# EasyEDA schematic ZYF-02-0-R-8A8K64D4-SCH.json
TITLE: Sheet_1; REV: 1.0; Date: 2023-05-22; Sheet: 1/1; Drawn By: zhaohad; Company: Your Company
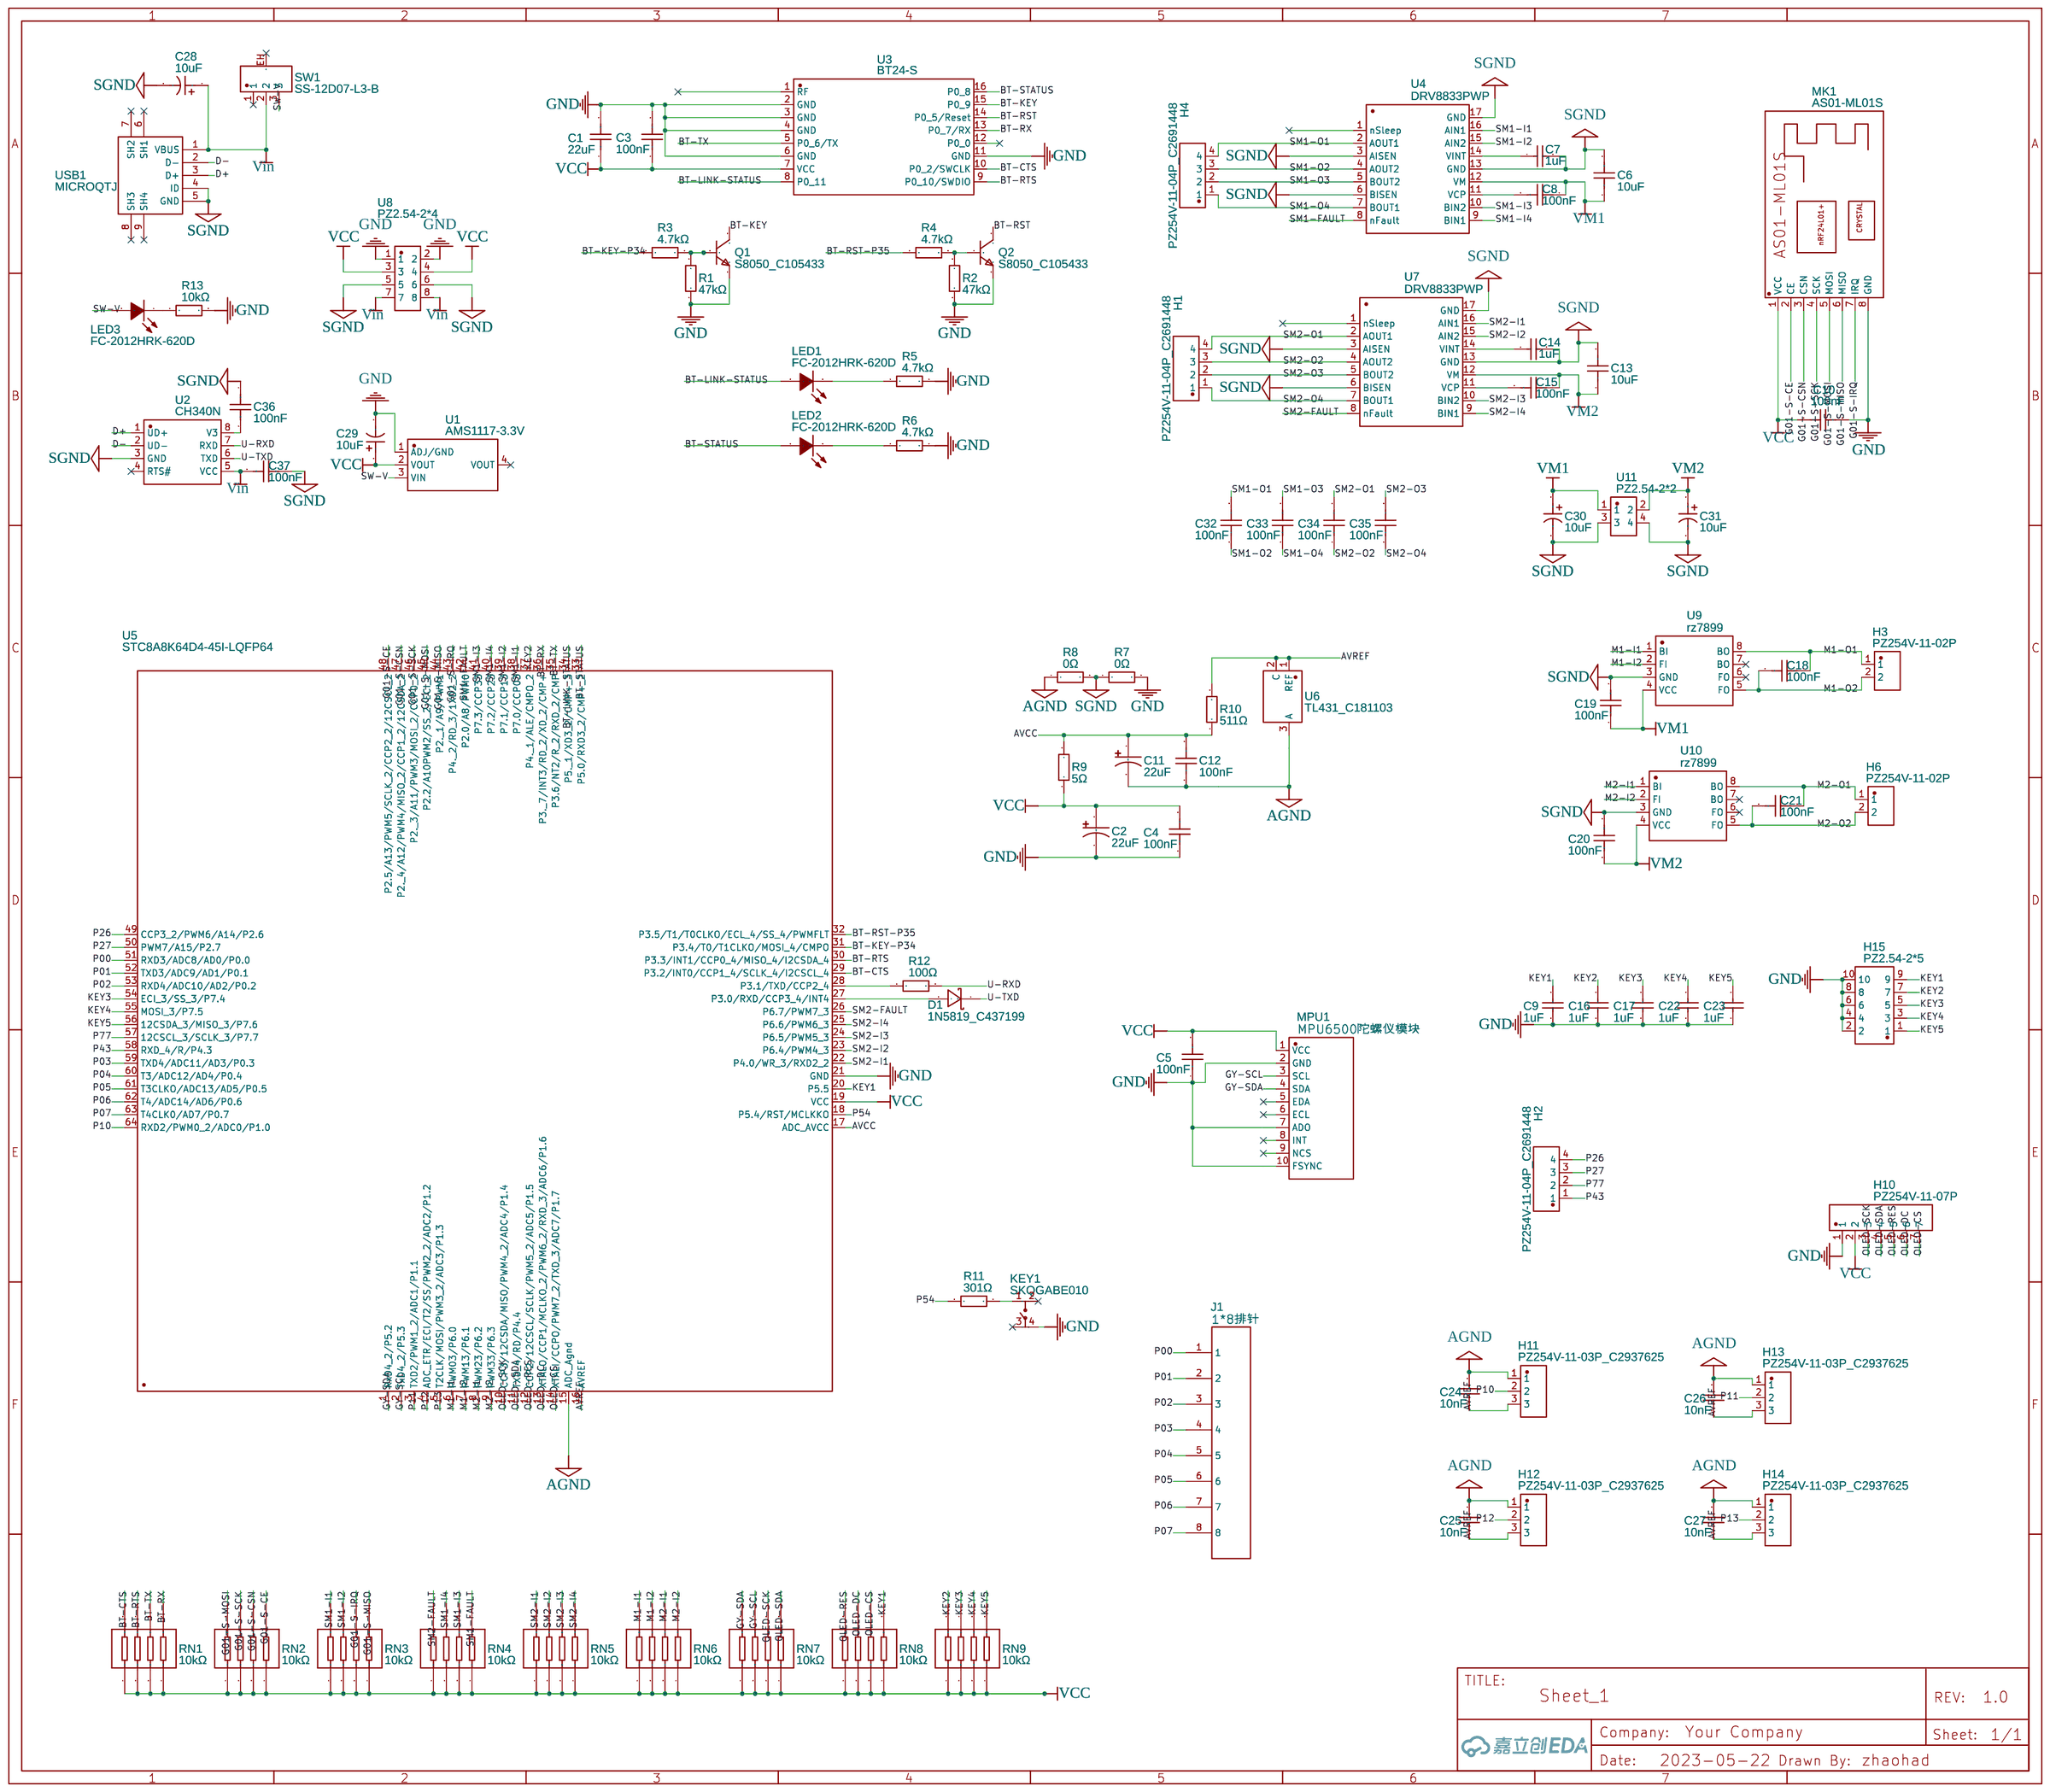
[diagram p0: schematic sheet]

## Parts
C1  22uF  [C0603]
C2  22uF  [CAP-SMD_BD6.3-L6.6-W6.6-FD]
C3  100nF  [C0603]
C4  100nF  [C0603]
C5  100nF  [C0603]
C6  10uF  [C0603]
C7  1uF  [C0603]
C8  100nF  [C0603]
C9  1uF  [C0603]
C10  100nF  [C0603]
C11  22uF  [CAP-SMD_BD6.3-L6.6-W6.6-FD]
C12  100nF  [C0603]
C13  10uF  [C0603]
C14  1uF  [C0603]
C15  100nF  [C0603]
C16  1uF  [C0603]
C17  1uF  [C0603]
C18  100nF  [C0603]
C19  100nF  [C0603]
C20  100nF  [C0603]
C21  100nF  [C0603]
C22  1uF  [C0603]
C23  1uF  [C0603]
C24  10nF  [C0603]
C25  10nF  [C0603]
C26  10nF  [C0603]
C27  10nF  [C0603]
C28  10uF  [CAP-SMD_BD5.0-L5.3-W5.3-LS6.3-FD]
C29  10uF  [CAP-SMD_BD5.0-L5.3-W5.3-LS6.3-FD]
C30  10uF  [CAP-SMD_BD5.0-L5.3-W5.3-LS6.3-FD]
C31  10uF  [CAP-SMD_BD5.0-L5.3-W5.3-LS6.3-FD]
C32  100nF  [C0603]
C33  100nF  [C0603]
C34  100nF  [C0603]
C35  100nF  [C0603]
C36  100nF  [C0603]
C37  100nF  [C0603]
D1  1N5819_C437199  [SMA_L4.4-W2.6-LS5.0-RD]
H1  PZ254V-11-04P_C2691448  [HDR-TH_4P-P2.54-V-M]
H2  PZ254V-11-04P_C2691448  [HDR-TH_4P-P2.54-V-M]
H3  PZ254V-11-02P  [HDR-TH_2P-P2.54-V-M]
H4  PZ254V-11-04P_C2691448  [HDR-TH_4P-P2.54-V-M]
H6  PZ254V-11-02P  [HDR-TH_2P-P2.54-V-M]
H10  PZ254V-11-07P  [HDR-TH_7P-P2.54-V-M]
H11  PZ254V-11-03P_C2937625  [HDR-TH_3P-P2.54-V-M]
H12  PZ254V-11-03P_C2937625  [HDR-TH_3P-P2.54-V-M]
H13  PZ254V-11-03P_C2937625  [HDR-TH_3P-P2.54-V-M]
H14  PZ254V-11-03P_C2937625  [HDR-TH_3P-P2.54-V-M]
H15  PZ2.54-2*5  [HDR-TH_10P-P2.54-V-M-R2-C5-S2.54-1]
J1  1*8排针  [1*8排针]
KEY1  SKQGABE010  [KEY-SMD_4P-L5.2-W5.2-P3.70-LS6.4]
LED1  FC-2012HRK-620D  [LED0805-RD_RED]
LED2  FC-2012HRK-620D  [LED0805-RD_RED]
LED3  FC-2012HRK-620D  [LED0805-RD_RED]
MK1  AS01-ML01S  [WIRELM-SMD_AS01-ML01S]
MPU1  MPU6500陀螺仪模块  [MPU6500]
Q1  S8050_C105433  [SOT-23-3_L2.9-W1.6-P1.90-LS2.8-BR]
Q2  S8050_C105433  [SOT-23-3_L2.9-W1.6-P1.90-LS2.8-BR]
R1  47kΩ  [R0603]
R2  47kΩ  [R0603]
R3  4.7kΩ  [R0603]
R4  4.7kΩ  [R0603]
R5  4.7kΩ  [R0603]
R6  4.7kΩ  [R0603]
R7  0Ω  [R0603]
R8  0Ω  [R0603]
R9  5Ω  [R0603]
R10  511Ω  [R0603]
R11  301Ω  [R0603]
R12  100Ω  [R0603]
R13  10kΩ  [R0603]
RN1  10kΩ  [RES-ARRAY-SMD_0603-8P-L3.2-W1.6-BL]
RN2  10kΩ  [RES-ARRAY-SMD_0603-8P-L3.2-W1.6-BL]
RN3  10kΩ  [RES-ARRAY-SMD_0603-8P-L3.2-W1.6-BL]
RN4  10kΩ  [RES-ARRAY-SMD_0603-8P-L3.2-W1.6-BL]
RN5  10kΩ  [RES-ARRAY-SMD_0603-8P-L3.2-W1.6-BL]
RN6  10kΩ  [RES-ARRAY-SMD_0603-8P-L3.2-W1.6-BL]
RN7  10kΩ  [RES-ARRAY-SMD_0603-8P-L3.2-W1.6-BL]
RN8  10kΩ  [RES-ARRAY-SMD_0603-8P-L3.2-W1.6-BL]
RN9  10kΩ  [RES-ARRAY-SMD_0603-8P-L3.2-W1.6-BL]
SW1  SS-12D07-L3-B  [SW-TH_SS-12D07-X-X]
U1  AMS1117-3.3V  [SOT-223-4_L6.5-W3.5-P2.30-LS7.0-BR]
U2  CH340N  [SOP-8_L5.0-W4.0-P1.27-LS6.0-BL]
U3  BT24-S  [BULETM-SMD_BT24-S]
U4  DRV8833PWP  [TSSOP-16_L5.0-W4.4-P0.65-LS6.4-BL-EP]
U5  STC8A8K64D4-45I-LQFP64  [LQFP-64_L10.0-W10.0-P0.50-LS12.0-BL]
U6  TL431_C181103  [SOT-23-3_L3.0-W1.7-P0.95-LS2.9-BR]
U7  DRV8833PWP  [TSSOP-16_L5.0-W4.4-P0.65-LS6.4-BL-EP]
U8  PZ2.54-2*4  [HDR-TH_8P-P2.54-V-M-R2-C4-S2.54]
U9  rz7899  [SOP-8_L4.9-W3.9-P1.27-LS6.0-BL]
U10  rz7899  [SOP-8_L4.9-W3.9-P1.27-LS6.0-BL]
U11  PZ2.54-2*2  [HDR-TH_4P-P2.54-V-M-R2-C2-S2.54]
USB1  MICROQTJ  [MICRO-USB-SMD_MICROQTJ]

## Library data of the parts
C1 = CL10A226MP8NUNE: Supplier: LCSC; Manufacturer: SAMSUNG(三星); Supplier Part: C86295; JLCPCB Part Class: Extended Part
C2 C11 = EEEFTH101XAP: Supplier: LCSC; Supplier Part: C165974; Manufacturer: PANASONIC(松下); Contributor: LCSC; JLCPCB Part Class: Extended Part
C3-C5 C8 C10 C12 C15 C18-C21 C32-C37 = CC0603KRX7R9BB104: Supplier: LCSC; Manufacturer: YAGEO(国巨); Supplier Part: C14663; JLCPCB Part Class: Basic Part
C6 C13 = CL10A106MA8NRNC: Supplier: LCSC; Manufacturer: SAMSUNG(三星); Supplier Part: C96446; JLCPCB Part Class: Basic Part
C7 C9 C14 C16 C17 C22-C27 = CL10A105KB8NNNC: Supplier: LCSC; Manufacturer: SAMSUNG(三星); Supplier Part: C15849; JLCPCB Part Class: Basic Part
C28-C31 = XT10UF50V90RV0071: Supplier: LCSC; Supplier Part: C2992603; Manufacturer: KNSCHA(科尼盛); Contributor: lcsc; JLCPCB Part Class: Extended Part
D1 = 1N5819_C437199: Supplier: LCSC; Supplier Part: C437199; Manufacturer: KEXIN(科信); Manufacturer Part: 1N5819; Contributor: LCSC; JLCPCB Part Class: Extended Part
H1 H2 H4 = PZ254V-11-04P_C2691448: Supplier: LCSC; Supplier Part: C2691448; Manufacturer: XFCN(兴飞); Manufacturer Part: PZ254V-11-04P; Contributor: LCSC; JLCPCB Part Class: Extended Part
H3 H6 = PZ254V-11-02P: Supplier: LCSC; Supplier Part: C492401; Manufacturer: XFCN(兴飞); Contributor: LCSC; JLCPCB Part Class: Extended Part
H10 = PZ254V-11-07P: Supplier: LCSC; Supplier Part: C492406; Manufacturer: XFCN(兴飞); Contributor: LCSC; JLCPCB Part Class: Extended Part
H11-H14 = PZ254V-11-03P_C2937625: Supplier: LCSC; Supplier Part: C2937625; Manufacturer: XFCN(兴飞); Manufacturer Part: PZ254V-11-03P; Contributor: LCSC; JLCPCB Part Class: Extended Part
H15 = PZ2.54-2*5: Supplier: LCSC; Supplier Part: C5156677; Manufacturer: ZHOURI(洲日); Contributor: lcsc; JLCPCB Part Class: Extended Part
J1 = 1*8排针: Manufacturer: ZHOUR; Manufacturer Part: 2.54-1*8; Supplier: LCSC; Supplier Part: C5156616; Contributor: j2714433901
KEY1 = SKQGABE010: Supplier: LCSC; Manufacturer: ALPS; Supplier Part: C115351; Contributor: ww22350777
LED1-LED3 = FC-2012HRK-620D: Supplier: LCSC; Manufacturer: 国星光电; Manufacturer Part: NCD0805R1; Supplier Part: C84256; JLCPCB Part Class: Basic Part
MK1 = AS01-ML01S: Supplier: LCSC; Manufacturer: Ashining(泽耀科技); Supplier Part: C84802; JLCPCB Part Class: Extended Part
MPU1 = MPU6500陀螺仪模块: Contributor: mohun
Q1 Q2 = S8050_C105433: Supplier: LCSC; Manufacturer: CJ(江苏长电/长晶); Manufacturer Part: S8050; Supplier Part: C105433; JLCPCB Part Class: Extended Part
R1 R2 = 0603WAF4702T5E: Supplier: LCSC; Manufacturer: UNI-ROYAL(厚声); Supplier Part: C25819; Resistance (Ohms): 47K; JLCPCB Part Class: Basic Part
R3-R6 R9 R11-R13 = 0603WAF4701T5E: Supplier: LCSC; Manufacturer: UNI-ROYAL(厚声); Supplier Part: C23162; Resistance (Ohms): 4.7K; JLCPCB Part Class: Basic Part
R7 R8 = 0603WAF0000T5E: Supplier: LCSC; Manufacturer: UNI-ROYAL(厚声); Supplier Part: C21189; Resistance (Ohms): 0; JLCPCB Part Class: Basic Part
R10 = 0603WAF5100T5E: Supplier: LCSC; Manufacturer: UNI-ROYAL(厚声); Supplier Part: C23193; Resistance (Ohms): 510; JLCPCB Part Class: Basic Part
RN1-RN9 = 4D03WGJ0103T5E: Supplier: LCSC; Manufacturer: UNI-ROYAL(厚声); Supplier Part: C29718; Resistance (Ohms): 10K; JLCPCB Part Class: Basic Part
SW1 = SS-12D07-L3-B: Supplier: LCSC; Supplier Part: C480343; Manufacturer: XKB Connectivity(中国星坤); Manufacturer Part: SS12D07L3B; Contributor: LCSC; JLCPCB Part Class: Extended Part
U1 = AMS1117-3.3V: Supplier: LCSC; Supplier Part: C2688239; Manufacturer: WPMtek(维攀微); Contributor: LCSC; JLCPCB Part Class: Extended Part
U2 = CH340N: Supplier: LCSC; Supplier Part: C506813; Manufacturer: WCH(南京沁恒); Contributor: LCSC; JLCPCB Part Class: Extended Part
U3 = BT24-S: Supplier: LCSC; Supplier Part: C9900007879; Manufacturer: null; link: https://atta.szlcsc.comnull; JLCPCB Part Class: Extended Part; Contributor: lcsc
U4 U7 = DRV8833PWP: Supplier: LCSC; Manufacturer: TI(德州仪器); Manufacturer Part: DRV8833PWPR; Supplier Part: C50506; JLCPCB Part Class: Extended Part
U5 = STC8A8K64D4-45I-LQFP64: Supplier: LCSC; Supplier Part: C9900000181; Manufacturer: null; JLCPCB Part Class: Extended Part; Contributor: LCSC
U6 = TL431_C181103: Supplier: LCSC; Supplier Part: C181103; Manufacturer: Hottech(合科泰); Manufacturer Part: TL431; Contributor: LCSC; JLCPCB Part Class: Extended Part
U8 = PZ2.54-2*4: Supplier: LCSC; Supplier Part: C5156676; Manufacturer: ZHOURI(洲日); link: https://atta.szlcsc.com/upload/public/pdf/source/20220923/0E7A4A94740FFD503E2D73F36F92C1EA.pdf; JLCPCB Part Class: Extended Part; Contributor: lcsc
U9 U10 = rz7899: Supplier: LCSC; Manufacturer: RZ(睿智微); Supplier Part: C92373; JLCPCB Part Class: Extended Part
U11 = PZ2.54-2*2: Supplier: LCSC; Supplier Part: C5156675; Manufacturer: ZHOURI(洲日); link: https://atta.szlcsc.com/upload/public/pdf/source/20220923/B99F04FBBE53F9D60C18D50D8418B40E.pdf; Contributor: lcsc
USB1 = MICROQTJ: Supplier: LCSC; Supplier Part: C404968; Manufacturer: SHOU HAN; Manufacturer Part: MicroQTJ; Contributor: LCSC; JLCPCB Part Class: Extended Part

## Nets
AGND: C11.2 C12.1 C24.2 C25.2 C26.2 C27.2 H11.1 H12.1 H13.1 H14.1 R8.1 U5.15(ADC_Agnd) U6.3(A)
AVCC: C11.1 C12.2 R9.2 R10.1 U5.17(ADC_AVCC)
GND: C1.2 C2.2 C3.2 C4.1 C5.1 C9.1 C10.1 C16.1 C17.1 C22.1 C23.1 C29.2 H10.1 H15.2 H15.4 H15.6 H15.8 H15.10 KEY1.4 MK1.8(GND) MPU1.2(GND) MPU1.7(ADO) MPU1.10(FSYNC) Q1.2 Q2.2 R1.1 R2.1 R5.2 R6.2 R7.2 R13.2 U1.1(ADJ/GND) U3.2(GND) U3.3(GND) U3.4(GND) U3.6(GND) U3.11(GND) U5.21(GND) U8.1 U8.2
SGND: C6.2 C7.2 C13.2 C14.2 C19.2 C20.2 C28.2 C30.2 C31.2 C36.1 C37.1 R7.1 R8.2 U2.3(GND) U4.3(AISEN) U4.6(BISEN) U4.13(GND) U4.17(GND) U7.3(AISEN) U7.6(BISEN) U7.13(GND) U7.17(GND) U8.5 U8.6 U9.3(GND) U10.3(GND) U11.3 U11.4 USB1.4(ID) USB1.5(GND)
VCC: C1.1 C2.1 C3.1 C4.2 C5.2 C10.2 C29.1 H10.2 MK1.1(VCC) MPU1.1(VCC) R9.1 RN1.1 RN1.2 RN1.3 RN1.4 RN2.1 RN2.2 RN2.3 RN2.4 RN3.1 RN3.2 RN3.3 RN3.4 RN4.1 RN4.2 RN4.3 RN4.4 RN5.1 RN5.2 RN5.3 RN5.4 RN6.1 RN6.2 RN6.3 RN6.4 RN7.1 RN7.2 RN7.3 RN7.4 RN8.1 RN8.2 RN8.3 RN8.4 RN9.1 RN9.2 RN9.3 RN9.4 U1.2(VOUT) U3.7(VCC) U5.19(VCC) U8.3 U8.4
Vin: C28.1 C37.2 SW1.2 U2.5(VCC) U8.7 U8.8 USB1.1(VBUS)
AVREF: C24.1 C25.1 C26.1 C27.1 H11.3 H12.3 H13.3 H14.3 R10.2 U5.16(AVREF) U6.1(REF) U6.2(C)
BT-CTS: RN1.8 U3.10(P0_2/SWCLK) U5.29(P3.2/INT0/CCP1_4/SCLK_4/I2CSCL_4)
BT-KEY: Q1.3 U3.15(P0_9)
BT-KEY-P34: R3.1 U5.31(P3.4/T0/T1CLKO/MOSI_4/CMPO)
BT-LINK-STATUS: LED1.2(+) U3.8(P0_11) U5.34(P5._1/XD3_2/CMP+_3)
BT-RST: Q2.3 U3.14(P0_5/Reset)
BT-RST-P35: R4.1 U5.32(P3.5/T1/T0CLKO/ECL_4/SS_4/PWMFLT)
BT-RTS: RN1.7 U3.9(P0_10/SWDIO) U5.30(P3.3/INT1/CCP0_4/MISO_4/I2CSDA_4)
BT-RX: RN1.5 U3.13(P0_7/RX) U5.36(P3._7/INT3/RD_2/XD_2/CMP+)
BT-STATUS: LED2.2(+) U3.16(P0_8) U5.33(P5.0/RXD3_2/CMP+_2)
BT-TX: RN1.6 U3.5(P0_6/TX) U5.35(P3.6/NT2/R_2/RXD_2/CMP)
D+: U2.1(UD+) USB1.3(D+)
D-: U2.2(UD-) USB1.2(D-)
G01-S-CE: MK1.2(CE) RN2.5 U5.48(P2.5/A13/PWM5/SCLK_2/CCP2_2/12CSCL_2)
G01-S-CSN: MK1.3(CSN) RN2.6 U5.47(P2._4/A12/PWM4/MISO_2/CCP1_2/12CSDA_2)
G01-S-IRQ: MK1.7(IRQ) RN3.6 U5.43(P4._2/RD_3/1XD2_2)
G01-S-MISO: MK1.6(MISO) RN3.5 U5.44(P2._1/A9/PWM1)
G01-S-MOSI: MK1.5(MOSI) RN2.8 U5.45(P2.2/A10PWM2/SS_2/ECI_2)
G01-S-SCK: MK1.4(SCK) RN2.7 U5.46(P2._3/A11/PWM3/MOSI_2/CCP0_2)
GY-SCL: MPU1.3(SCL) RN7.7 U5.2(TxD4_2/P5.3)
GY-SDA: MPU1.4(SDA) RN7.8 U5.1(RxD4_2/P5.2)
KEY1: C9.2 H15.9 RN8.5 U5.20(P5.5)
KEY2: C16.2 H15.7 RN9.8 U5.37(P4._1/ALE/CMPO_2)
KEY3: C17.2 H15.5 RN9.7 U5.54(ECI_3/SS_3/P7.4)
KEY4: C22.2 H15.3 RN9.6 U5.55(MOSI_3/P7.5)
KEY5: C23.2 H15.1 RN9.5 U5.56(12CSDA_3/MISO_3/P7.6)
M1-I1: RN6.8 U5.6(PWM03/P6.0) U9.1(BI)
M1-I2: RN6.7 U5.7(PWM13/P6.1) U9.2(FI)
M1-O1: C18.1 H3.1 U9.8(BO)
M1-O2: C18.2 H3.2 U9.5(FO)
M2-I1: RN6.6 U5.8(PWM23/P6.2) U10.1(BI)
M2-I2: RN6.5 U5.9(PWM33/P6.3) U10.2(FI)
M2-O1: C21.1 H6.1 U10.8(BO)
M2-O2: C21.2 H6.2 U10.5(FO)
OLED-CS: H10.7 RN8.6 U5.14(XTALI/CCPO/PWM7_2/TXD_3/ADC7/P1.7)
OLED-DC: H10.6 RN8.7 U5.13(XTALO/CCP1/MCLKO_2/PWM6_2/RXD_3/ADC6/P1.6)
OLED-RES: H10.5 RN8.8 U5.12(CCP2/12CSCL/SCLK/PWM5_2/ADC5/P1.5)
OLED-SCK: H10.3 RN7.6 U5.10(CCP3/12CSDA/MISO/PWM4_2/ADC4/P1.4)
OLED-SDA: H10.4 RN7.5 U5.11(TXD_4/RD/P4.4)
P00: J1.1 U5.51(RXD3/ADC8/AD0/P0.0)
P01: J1.2 U5.52(TXD3/ADC9/AD1/P0.1)
P02: J1.3 U5.53(RXD4/ADC10/AD2/P0.2)
P03: J1.4 U5.59(TXD4/ADC11/AD3/P0.3)
P04: J1.5 U5.60(T3/ADC12/AD4/P0.4)
P05: J1.6 U5.61(T3CLKO/ADC13/AD5/P0.5)
P06: J1.7 U5.62(T4/ADC14/AD6/P0.6)
P07: J1.8 U5.63(T4CLK0/AD7/P0.7)
P10: H11.2 U5.64(RXD2/PWM0_2/ADC0/P1.0)
P11: H13.2 U5.3(TXD2/PWM1_2/ADC1/P1.1)
P12: H12.2 U5.4(ADC_ETR/ECI/T2/SS/PWM2_2/ADC2/P1.2)
P13: H14.2 U5.5(T2CLK/MOSI/PWM3_2/ADC3/P1.3)
P26: H2.4 U5.49(CCP3_2/PWM6/A14/P2.6)
P27: H2.3 U5.50(PWM7/A15/P2.7)
P43: H2.1 U5.58(RXD_4/R/P4.3)
P54: R11.2 U5.18(P5.4/RST/MCLKKO)
P77: H2.2 U5.57(12CSCL_3/SCLK_3/P7.7)
SM1-FAULT: RN4.5 U4.8(nFault) U5.42(P2.0/A8/PWM0)
SM1-I1: RN3.8 U4.16(AIN1) U5.38(P7.0/CCP03)
SM1-I2: RN3.7 U4.15(AIN2) U5.39(P7.1/CCP13)
SM1-I3: RN4.6 U4.10(BIN2) U5.41(P7.3/CCP33)
SM1-I4: RN4.7 U4.9(BIN1) U5.40(P7.2/CCP23)
SM1-O1: C32.2 H4.4 U4.2(AOUT1)
SM1-O2: C32.1 H4.3 U4.4(AOUT2)
SM1-O3: C33.2 H4.2 U4.5(BOUT2)
SM1-O4: C33.1 H4.1 U4.7(BOUT1)
SM2-FAULT: RN4.8 U5.26(P6.7/PWM7_3) U7.8(nFault)
SM2-I1: RN5.8 U5.22(P4.0/WR_3/RXD2_2) U7.16(AIN1)
SM2-I2: RN5.7 U5.23(P6.4/PWM4_3) U7.15(AIN2)
SM2-I3: RN5.6 U5.24(P6.5/PWM5_3) U7.10(BIN2)
SM2-I4: RN5.5 U5.25(P6.6/PWM6_3) U7.9(BIN1)
SM2-O1: C34.2 H1.4 U7.2(AOUT1)
SM2-O2: C34.1 H1.3 U7.4(AOUT2)
SM2-O3: C35.2 H1.2 U7.5(BOUT2)
SM2-O4: C35.1 H1.1 U7.7(BOUT1)
SW-V: LED3.2(+) SW1.3 U1.3(VIN)
U-RXD: R12.2 U2.7(RXD)
U-TXD: D1.1(C) U2.6(TXD)
VM1: C6.1 C8.1 C19.1 C30.1 U4.12(VM) U9.4(VCC) U11.1
VM2: C13.1 C15.1 C20.1 C31.1 U7.12(VM) U10.4(VCC) U11.2
Net-(C7-1): C7.1 U4.14(VINT)
Net-(C8-2): C8.2 U4.11(VCP)
Net-(C14-1): C14.1 U7.14(VINT)
Net-(C15-2): C15.2 U7.11(VCP)
Net-(C36-2): C36.2 U2.8(V3)
Net-(D1-2): D1.2(A) U5.27(P3.0/RXD/CCP3_4/INT4)
Net-(KEY1-1): KEY1.1 R11.1
Net-(LED1-1): LED1.1(-) R5.1
Net-(LED2-1): LED2.1(-) R6.1
Net-(LED3-1): LED3.1(-) R13.1
Net-(Q1-1): Q1.1 R1.2 R3.2
Net-(Q2-1): Q2.1 R2.2 R4.2
Net-(R12-1): R12.1 U5.28(P3.1/TXD/CCP2_4)

Not connected (* = marked no-connect by the designer): KEY1 2* 3*; MPU1 5(EDA) 6(ECL) 8(INT) 9(NCS); SW1 1* EH*; U1 4(VOUT)*; U2 4(RTS#)*; U3 1(RF) 12(P0_0); U4 1(nSleep); U7 1(nSleep); U9 6(FO)* 7(BO)*; U10 6(FO)* 7(BO)*; USB1 6(SH1)* 7(SH2)* 8(SH3)* 9(SH4)*
